# Altium schematic sheet tranciever.SchDoc: Tranciever Circuit
size A4; DrawnBy: Thomas Mehes; SheetNumber: 3; SheetTotal: 6
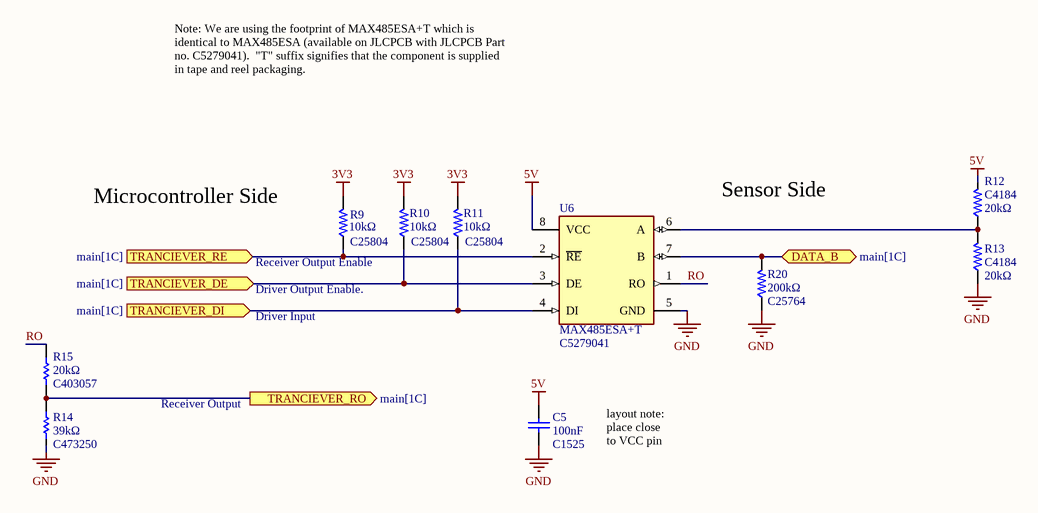
[diagram p0: tranciever.SchDoc]

## Parts
C5  JLCPCB Part: C1525  Capacitance: 100nF  [CAPC1050X55X23NL05T13]  (hidden comment: CL05B104KO5NNNC)
R9  Resistance: 10kΩ  JLCPCB Part: C25804  [RES-0603]  (hidden comment: 0603WAF1002T5E)
R10  Resistance: 10kΩ  JLCPCB Part: C25804  [RES-0603]  (hidden comment: 0603WAF1002T5E)
R11  Resistance: 10kΩ  JLCPCB Part: C25804  [RES-0603]  (hidden comment: 0603WAF1002T5E)
R12  Resistance: 20kΩ  JLCPCB Part: C4184  [RES-0603]  (hidden comment: 0603WAF2002T5E)
R13  Resistance: 20kΩ  JLCPCB Part: C4184  [RES-0603]  (hidden comment: 0603WAF2002T5E)
R14  JLCPCB Part: C473250  Resistance: 39kΩ  [RESC1608X55X30LL20T20]  (hidden comment: ERA-3AEB393V)
R15  Resistance: 20kΩ  JLCPCB Part: C403057  [RESC1608X55X30ML15T15]  (hidden comment: ERJ-3EKF2002V)
R20  Resistance: 200kΩ  JLCPCB Part: C25764  [RES-0402]  (hidden comment: 0402WGF2003TCE)
U6  MAX485ESA+T  JLCPCB Part: C5279041  [FP-S8-2-MFG]

## Ports
DATA_B (bidir, see main[1C]), TRANCIEVER_DE (in, see main[1C]), TRANCIEVER_DI (in, see main[1C]), TRANCIEVER_RE (in, see main[1C]), TRANCIEVER_RO (out, see main[1C])

## Nets
3V3: R9.2 R10.2 R11.2
5V: C5.2 R12.2 U6.8(VCC)
GND: C5.1 R13.1 R14.1 R20.1 U6.5(GND)
DATA_B: R20.2 U6.7(B) ; port DATA_B
RO: R15.2 U6.1(RO)
TRANCIEVER_DE: R10.1 U6.3(DE) ; port TRANCIEVER_DE
TRANCIEVER_DI: R11.1 U6.4(DI) ; port TRANCIEVER_DI
TRANCIEVER_RE: R9.1 U6.2(~{RE}) ; port TRANCIEVER_RE
TRANCIEVER_RO: R14.2 R15.1 ; port TRANCIEVER_RO
NetR12_1: R12.1 R13.2 U6.6(A)

## Notes on the sheet
- Note: We are using the footprint of MAX485ESA+T which is identical to MAX485ESA (available on JLCPCB with JLCPCB Part no. C5279041).  "T" suffix signifies that the component is supplied in tape and reel packaging.
- Sensor Side
- Microcontroller Side
- Receiver Output Enable
- Driver Output Enable.
- Driver Input
- Receiver Output
- layout note: place close to VCC pin
- Date:
- Sheet
- of
- Time:
- Revision:
- Drawn by:
- File:

## Library data of the parts
C5 = CMP-00007-3: Chip Capacitor, 100 nF, +/- 10%, 16 V, -55 to 125 degC, 0402 (1005 Metric), RoHS, Tape and Reel; Manufacturer: Samsung Electro-Mechanics; Rated Voltage: 16V; Dielectric: X7R; Manufacturer URL: http://www.samsungsem.com/global/index.jsp; Datasheet Version: Nov-10; Case Size/Dimension: 0402; Tolerance (%): ±10%; Datasheet URL: https://datasheet.ciiva.com/29198/458718-da-01-en-vs-kondensator-0402-29198423.pdf
R9-R11 = CMP-009-00072-1: Resistor, 10kΩ, ±1%, 100mW, 75V, ±100ppm/℃, -55℃~+155℃, SMD 0603; Manufacturer: Uniroyal; Source: jlcpcb_resistors_basic.schlib; ComponentLink2Description: JLCPCB Part URL; ComponentLink1URL: https://datasheet.lcsc.com/lcsc/2206010045_UNI-ROYAL-Uniroyal-Elec-0603WAF1002T5E_C25804.pdf; ComponentLink2URL: https://jlcpcb.com/partdetail/C25804; Temperature Coefficient: ±100ppm/℃; Manufacturer Part Number: 0603WAF1002T5E; Power Rating: 100mW; ComponentLink1Description: Datasheet; Design Item ID: 0603WAF1002T5E; Category: Resistors; Tolerance: ±1%; Package Size: 0603; JLCPCB Basic Part: Yes; Temperature Rating: -55℃~+155℃; Voltage Rating: 75V
R12 R13 = CMP-009-00100-1: Resistor, 20kΩ, ±1%, 100mW, 75V, ±100ppm/℃, -55℃~+155℃, SMD 0603; Manufacturer: Uniroyal; Temperature Rating: -55℃~+155℃; Tolerance: ±1%; Package Size: 0603; Category: Resistors; ComponentLink2Description: JLCPCB Part URL; ComponentLink2URL: https://jlcpcb.com/partdetail/C4184; ComponentLink1Description: Datasheet; Source: jlcpcb_resistors_basic.schlib; Manufacturer Part Number: 0603WAF2002T5E; ComponentLink1URL: https://datasheet.lcsc.com/lcsc/2206010230_UNI-ROYAL-Uniroyal-Elec-0603WAF2002T5E_C4184.pdf; JLCPCB Basic Part: Yes; Power Rating: 100mW; Temperature Coefficient: ±100ppm/℃; Voltage Rating: 75V; Design Item ID: 0603WAF2002T5E
  R12: JLCPCB Part Number: C4184
R14 = CMP-2000-00055-1: Manufacturer: Panasonic; Part Number: ERA-3AEB393V
R15 = CMP-2000-00318-1: Manufacturer: Panasonic; Part Number: ERJ-3EKF2002V
R20 = CMP-009-00025-1: Resistor, 200kΩ, ±1%, 62.5mW, 50V, ±100ppm/℃, -55℃~+155℃, SMD 0402; Manufacturer: Uniroyal; Tolerance: ±1%; JLCPCB Basic Part: Yes; Source: jlcpcb_resistors_basic.schlib; ComponentLink2Description: JLCPCB Part URL; Temperature Rating: -55℃~+155℃; ComponentLink1URL: https://datasheet.lcsc.com/lcsc/2206010100_UNI-ROYAL-Uniroyal-Elec-0402WGF2003TCE_C25764.pdf; ComponentLink2URL: https://jlcpcb.com/partdetail/C25764; Voltage Rating: 50V; Package Size: 0402; Power Rating: 62.5mW; Design Item ID: 0402WGF2003TCE; Manufacturer Part Number: 0402WGF2003TCE; Temperature Coefficient: ±100ppm/℃; ComponentLink1Description: Datasheet; Category: Resistors
U6 = CMP-05679-000009-1: IC TRANSCEIVER HALF 1/1 8SOIC; Manufacturer: Maxim Integrated; Min Supply Voltage: 4.75V; Nominal Supply Current: 0.5mA; Number Of Transmitters: 1; Data Rate: 2.5Mbits/s; Interface: RS-485,RS-422; Standoff Height: 0.1mm; Max Supply Voltage: 5.25V; Simplex Duplex: Half-Duplex; Package: S8-2; Temperature: -40°C to +85°C; Device Class L1: Integrated Circuits (ICs); Footprint Url: https://pdfserv.maximintegrated.com/land_patterns/90-0096.PDF; ComponentLink2URL: https://datasheets.maximintegrated.com/en/ds/MAX1487-MAX491.pdf; Height: 1.75mm; Mouser Description: RS-422/RS-485 Interface IC RS-485/RS-422 Transceiver; Octopart: https://octopart.com/max485esa%2Bt-maxim+integrated-40011239; RoHS: TRUE; ComponentLink2Description: Datasheet; Temperature Range Low: -40°C; Number Of Receivers: 1; Manufacturer Part Number: MAX485ESA+T; Ipc Land Pattern Name: SOIC127P600X155-8; Device Class L3: RS-232 / RS-422 / RS-485 Interface ICs; Automotive: No; Digikey Description: IC TRANSCEIVER HALF 1/1 8SOIC; Temperature Range High: +85°C; Category: IC; Device Class L2: Interface ICs; Lead Free: Yes